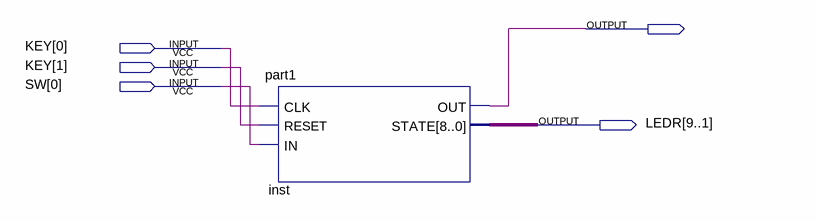
[diagram p0: schematic sheet]
// Quartus schematic part1_sch.bdf as structural Verilog: 1 symbols, 5 pins
module part1_sch (
  input  [1:0] KEY,
  input  [0:0] SW,
  output [9:1] LEDR
);

  wire inst_out;

  part1 inst (.CLK(KEY[0]), .RESET(KEY[1]), .IN(SW[0]), .OUT(inst_out), .STATE(LEDR));
endmodule
